# EAGLE design avr (EAGLE 6.5.0)
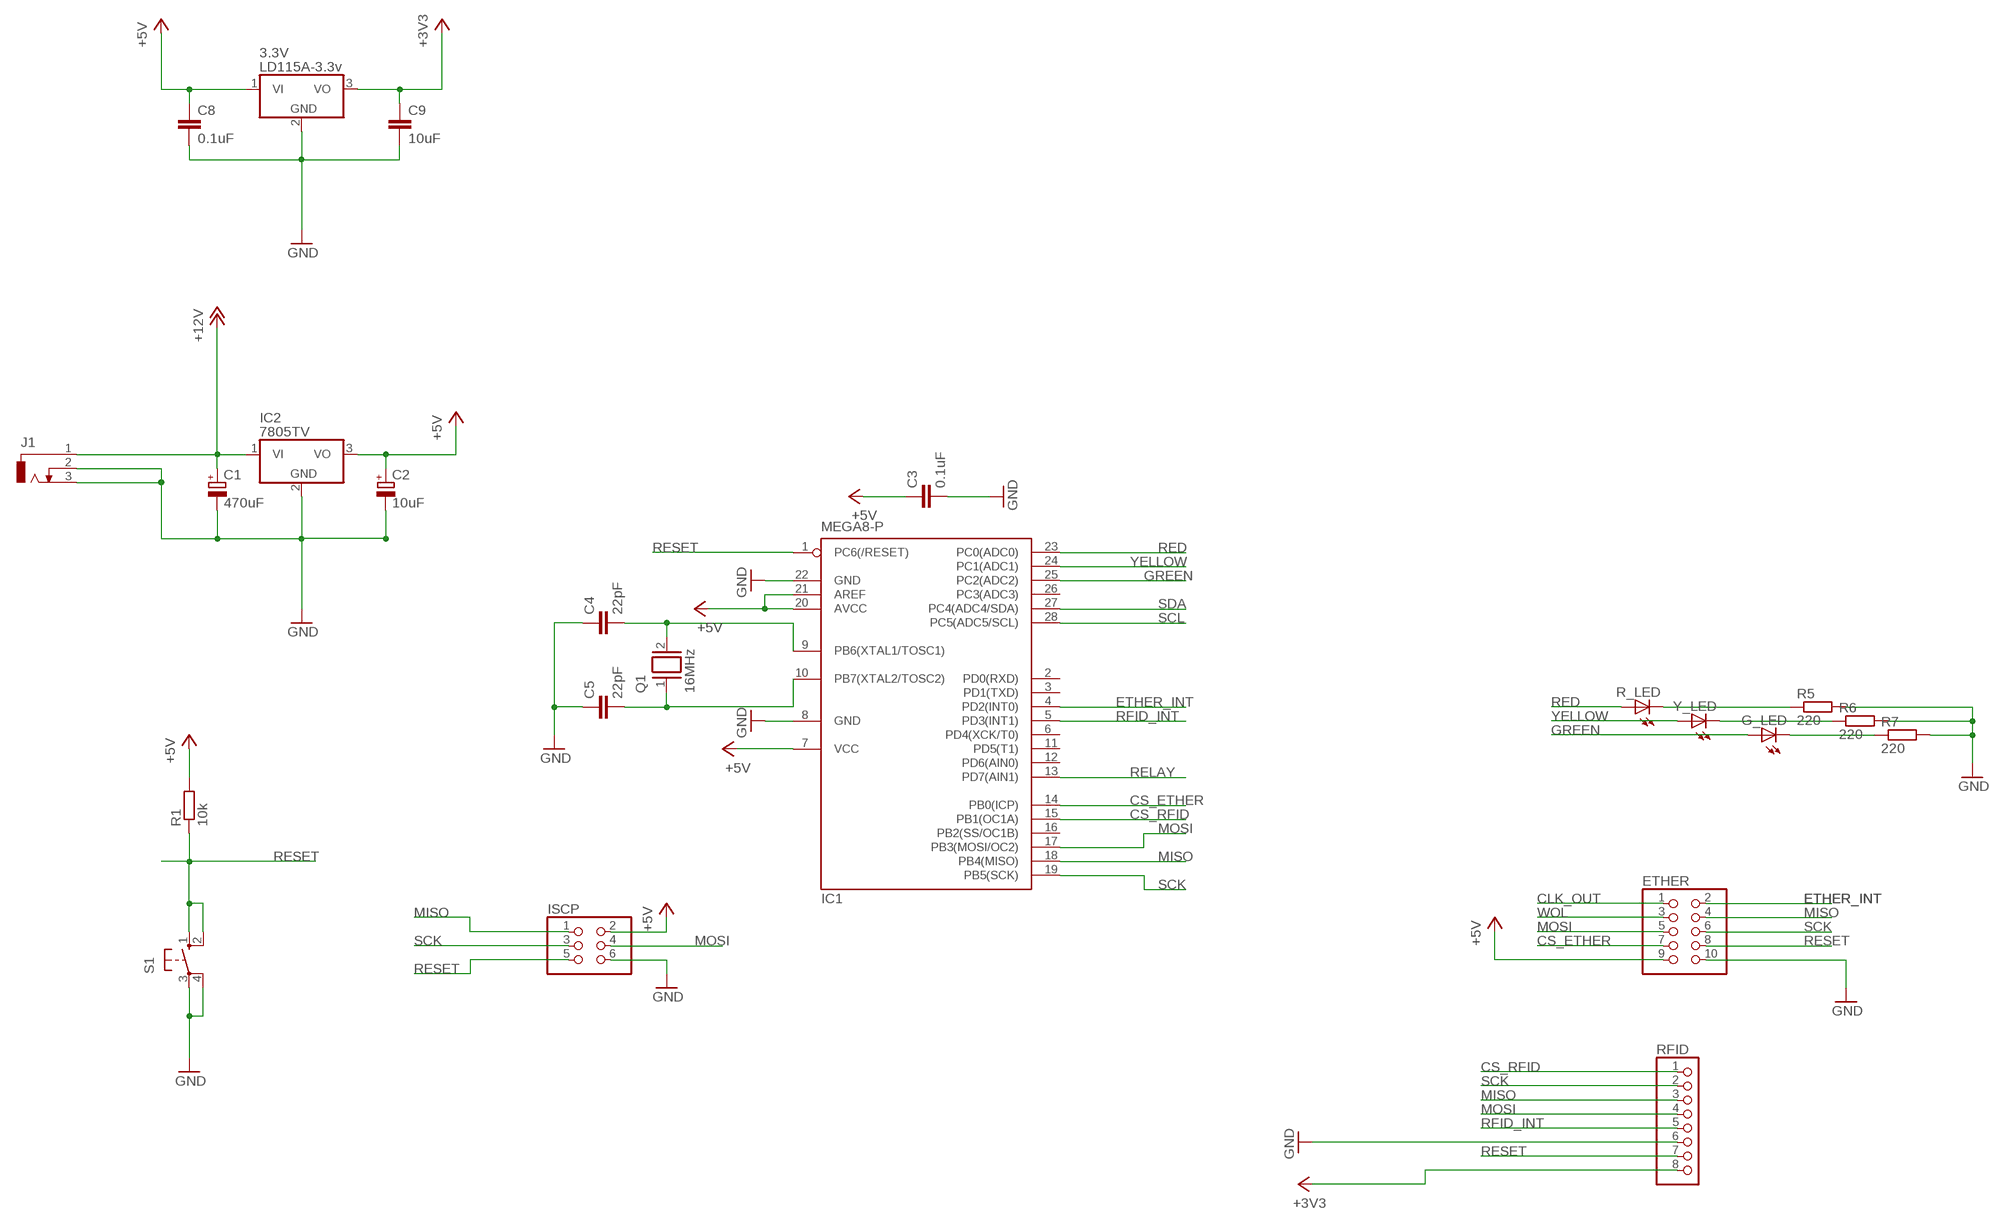
[diagram p0: schematic, sheet 1]

## Parts
3.3V  LD115A-3.3v  7805TV  [TO220V]
C1  470uF  CPOL-EUE3.5-10  [E3,5-10]
C2  10uF  CPOL-EUE3.5-10  [E3,5-10]
C3  0.1uF  C-EU050-025X075  [C050-025X075]
C4  22pF  C-EU050-025X075  [C050-025X075]
C5  22pF  C-EU050-025X075  [C050-025X075]
C8  0.1uF  C-EU050-025X075  [C050-025X075]
C9  10uF  C-EU050-025X075  [C050-025X075]
ETHER  PINHD-2X5  [2X05]
G_LED  LED5MM  [LED5MM]
IC1  MEGA8-P  [DIL28-3]
IC2  7805TV  [TO220V]
ISCP  PINHD-2X3  [2X03]
J1  DCJ0303  [DCJ0303]
Q1  16MHz  XTAL/S  [QS]
R1  10k  R-EU_0207/10  [0207/10]
R5  220  R-EU_0207/10  [0207/10]
R6  220  R-EU_0207/10  [0207/10]
R7  220  R-EU_0207/10  [0207/10]
R_LED  LED5MM  [LED5MM]
RFID  PINHD-1X8  [1X08]
S1  10-XX  [B3F-10XX]
Y_LED  LED5MM  [LED5MM]

## Nets
+3V3: 3.3V.3(VO) C9.1 RFID.8
+5V: 3.3V.1(VI) C2.+ C3.1 C8.1 ETHER.9 IC1.7(VCC) IC1.20(AVCC) IC1.21(AREF) IC2.3(VO) ISCP.2 R1.2
+12V: C1.+ IC2.1(VI) J1.1
CLK_OUT: ETHER.1
CS_ETHER: ETHER.7 IC1.14(PB0(ICP))
CS_RFID: IC1.15(PB1(OC1A)) RFID.1
ETHER_INT: ETHER.2 IC1.4(PD2(INT0))
GND: 3.3V.2(GND) C1.- C2.- C3.2 C4.1 C5.1 C8.2 C9.2 ETHER.10 IC1.8(GND) IC1.22(GND) IC2.2(GND) ISCP.6 J1.2 J1.3 R5.2 R6.2 R7.2 RFID.6 S1.3(P) S1.4(P1)
GREEN: G_LED.A IC1.25(PC2(ADC2))
MISO: ETHER.4 IC1.18(PB4(MISO)) ISCP.1 RFID.3
MOSI: ETHER.5 IC1.17(PB3(MOSI/OC2)) ISCP.4 RFID.4
N$2: R5.1 R_LED.K(C)
N$3: C4.2 IC1.9(PB6(XTAL1/TOSC1)) Q1.2
N$4: R6.1 Y_LED.K(C)
N$5: C5.2 IC1.10(PB7(XTAL2/TOSC2)) Q1.1
N$6: G_LED.K(C) R7.1
RED: IC1.23(PC0(ADC0)) R_LED.A
RELAY: IC1.13(PD7(AIN1))
RESET: ETHER.8 IC1.1(PC6(/RESET)) ISCP.5 R1.1 RFID.7 S1.1(S) S1.2(S1)
RFID_INT: IC1.5(PD3(INT1)) RFID.5
SCK: ETHER.6 IC1.19(PB5(SCK)) ISCP.3 RFID.2
SCL: IC1.28(PC5(ADC5/SCL))
SDA: IC1.27(PC4(ADC4/SDA))
WOL: ETHER.3
YELLOW: IC1.24(PC1(ADC1)) Y_LED.A
Unconnected: IC1.2(PD0(RXD)) IC1.3(PD1(TXD)) IC1.6(PD4(XCK/T0)) IC1.11(PD5(T1)) IC1.12(PD6(AIN0)) IC1.16(PB2(SS/OC1B)) IC1.26(PC3(ADC3))

## Library data of the parts
3.3V IC2 = linear:78*: Positive VOLTAGE REGULATOR Source: http://cache.national.com/ds/LM/LM78L05.pdf http://www.fairchildsemi.com/ds/LM/LM7805.pdf
C1 C2 = resistor:CPOL-EU: POLARIZED CAPACITOR, European symbol
C3-C5 C8 C9 = resistor:C-EU: CAPACITOR, European symbol
ETHER = pinhead:PINHD-2X5: PIN HEADER
G_LED R_LED Y_LED = led:LED: LED OSRAM: - CHIPLED LG R971, LG N971, LY N971, LG Q971, LY Q971, LO R971, LY R971 LH N974, LH R974 LS Q976, LO Q976, LY Q976 LO Q996 - Hyper CHIPLED LW Q18S LB Q993, LB Q99A, LB R99A - SideLED LS A670, LO A670, LY A670, LG A670, LP A670 LB A673, LV A673, LT A673, LW A673 LH A674 LY A675 LS A676, LA A676, LO A676, LY A676, LW A676 LS A679, LY A679, LG A679 - Hyper Micro SIDELED® LS Y876, LA Y876, LO Y876, LY Y876 LT Y87S - SmartLED LW L88C, LW L88S LB L89C, LB L89S, LG L890 LS L89K, LO L89K, LY L89K LS L896, LA L896, LO L896, LY L896 - TOPLED LS T670, LO T670, LY T670, LG T670, LP T670 LSG T670, LSP T670, LSY T670, LOP T670, LYG T670 LG T671, LOG T671, LSG T671 LB T673, LV T673, LT T673, LW T673 LH T674 LS T676, LA T676, LO T676, LY T676, LB T676, LH T676, LSB T676, LW T676 LB T67C, LV T67C, LT T67C, LS T67K, LO T67K, LY T67K, LW E67C LS E67B, LA E67B, LO E67B, LY E67B, LB E67C, LV E67C, LT E67C LW T67C LS T679, LY T679, LG T679 LS T770, LO T770, LY T770, LG T770, LP T770 LB T773, LV T773, LT T773, LW T773 LH T774 LS E675, LA E675, LY E675, LS T675 LS T776, LA T776, LO T776, LY T776, LB T776 LHGB T686 LT T68C, LB T68C - Hyper Mini TOPLED® LB M676 - Mini TOPLED Santana® LG M470 LS M47K, LO M47K, LY M47K Source: http://www.osram.convergy.de LUXEON: - LUMILED® LXK2-PW12-R00, LXK2-PW12-S00, LXK2-PW14-U00, LXK2-PW14-V00 LXK2-PM12-R00, LXK2-PM12-S00, LXK2-PM14-U00 LXK2-PE12-Q00, LXK2-PE12-R00, LXK2-PE12-S00, LXK2-PE14-T00, LXK2-PE14-U00 LXK2-PB12-K00, LXK2-PB12-L00, LXK2-PB12-M00, LXK2-PB14-N00, LXK2-PB14-P00, LXK2-PB14-Q00 LXK2-PR12-L00, LXK2-PR12-M00, LXK2-PR14-Q00, LXK2-PR14-R00 LXK2-PD12-Q00, LXK2-PD12-R00, LXK2-PD12-S00 LXK2-PH12-R00, LXK2-PH12-S00 LXK2-PL12-P00, LXK2-PL12-Q00, LXK2-PL12-R00 Source: www.luxeon.com KINGBRIGHT: KA-3528ASYC Source: www.kingbright.com
IC1 = atmel:MEGA8-P: MICROCONTROLLER 8 Kbytes FLASH, 1 kbytes SRAM, 512 bytes EEPROM, USART, 4-channel 10 bit ADC, 2-channel 8 bit ADC Pin compatible with Atmega48, ATMega88, ATMega168 Source: avr.lbr; OC_FARNELL: unknown; OC_NEWARK: unknown
ISCP = pinhead:PINHD-2X3: PIN HEADER
J1 = con-jack:DCJ0303: DC POWER JACK Source: DCJ0303.pdf; OC_FARNELL: unknown; OC_NEWARK: unknown
Q1 = special:XTAL/S: CRYSTAL
R1 R5-R7 = resistor:R-EU_: RESISTOR, European symbol
RFID = pinhead:PINHD-1X8: PIN HEADER
S1 = switch-omron:10-XX: OMRON SWITCH; MPN: B3F-1000; OC_FARNELL: 176432; OC_NEWARK: 36M3542

## Board
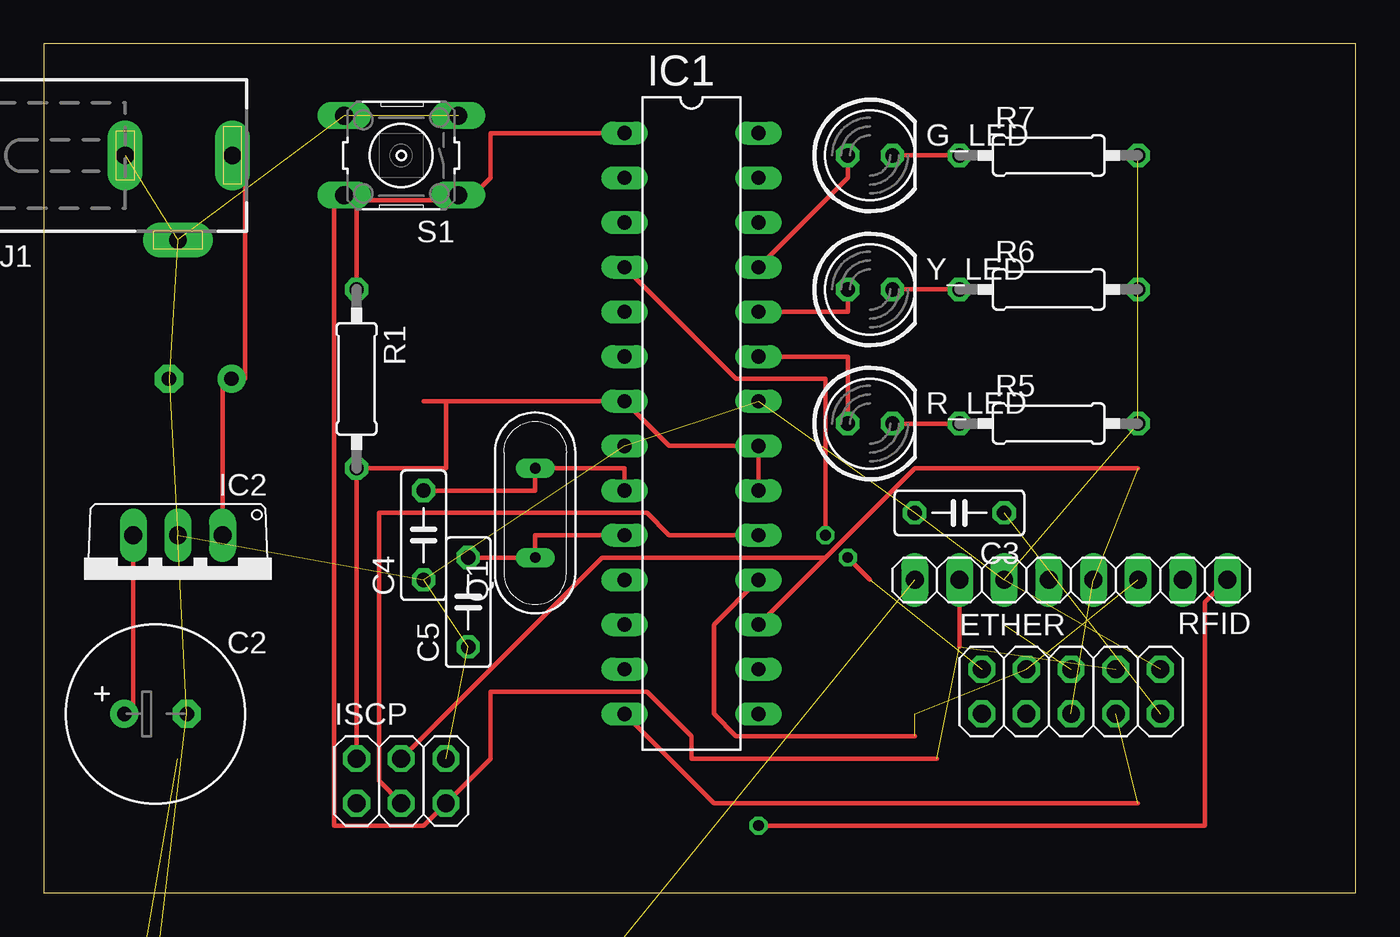
[diagram p1: board, top side]
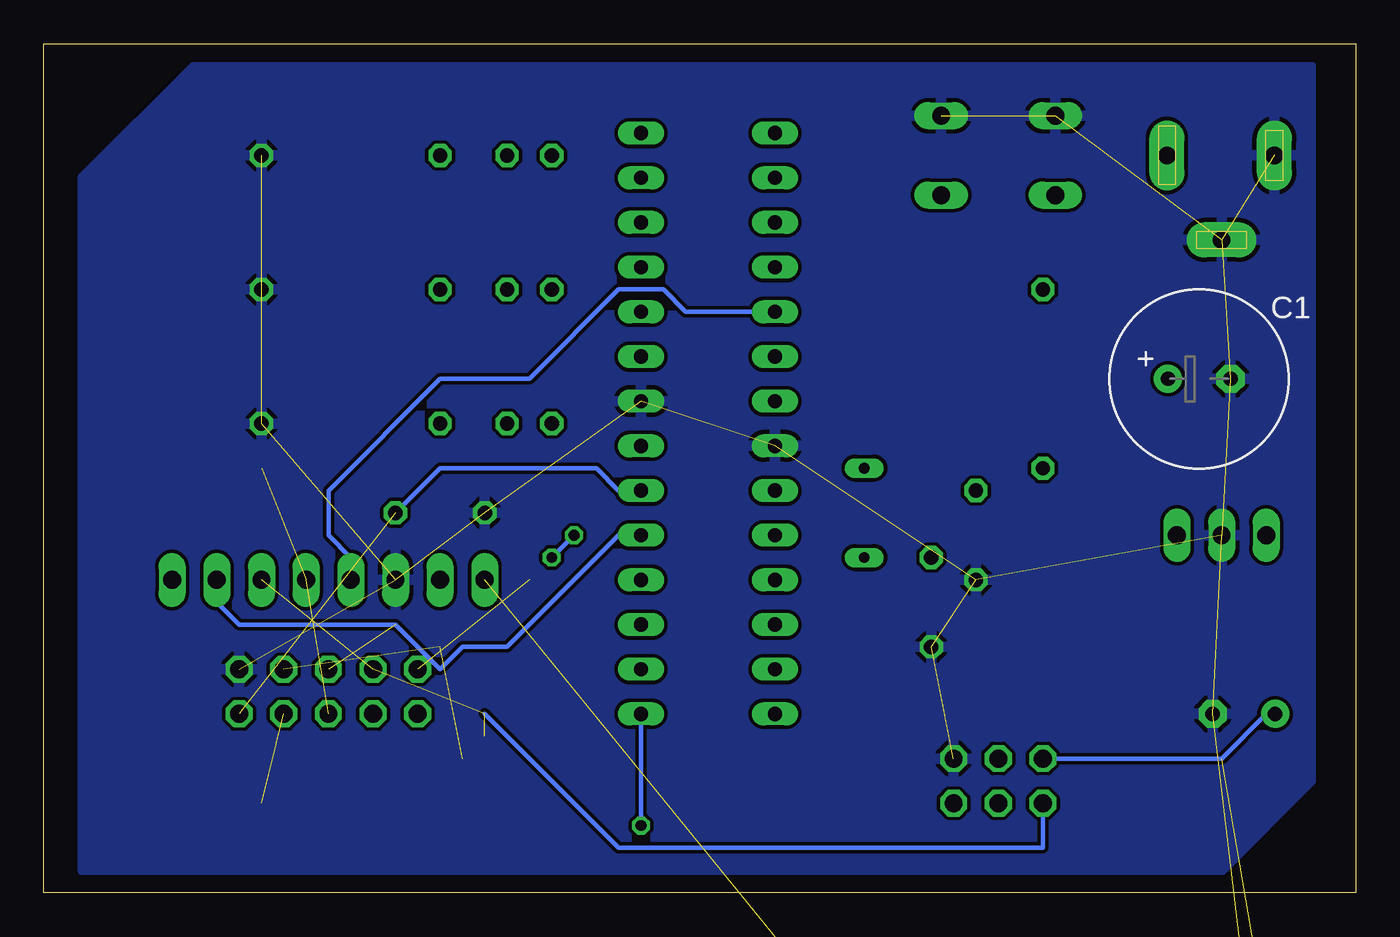
[diagram p2: board, bottom side, seen from below]

Size 74.6 x 48.25 mm. Coordinates in mm from the lower left corner, seen from the top.
Outline: 0,0 74.6,0 74.6,48.25 0,48.25 0,0
Copper layers (1*16): Top 0.035mm / dielectric 1.5mm / Bottom 0.035mm
Design rules "default": minimum track width 10mil, minimum drill 24mil, track to track 8mil, track to pad 8mil, pad to pad 8mil, via to via 8mil, smd to smd 8mil, copper to edge 40mil, drill to drill 8mil, minimum pad ring 10mil, minimum via ring 8mil, stop-mask expansion 4mil, vias tented up to drill 0mil, thermal gap 10mil

### Footprints (pad centres in the part's own frame; a part is rotated, then mirrored left to right if it is on the bottom)
TO220V = drill 1.016 long: 1 -2.54,-2.54; 2 0,-2.54; 3 2.54,-2.54
E3,5-10 = drill 0.813 pad 1.6: + -1.778,0 | drill 0.813 pad 1.6 octagon: - 1.778,0
C050-025X075 = drill 0.813 octagon: 1 -2.54,0; 2 2.54,0
2X05 = drill 1.016 octagon: 1 -5.08,-1.27; 2 -5.08,1.27; 3 -2.54,-1.27; 4 -2.54,1.27; 5 0,-1.27; 6 0,1.27; 7 2.54,-1.27; 8 2.54,1.27; 9 5.08,-1.27; 10 5.08,1.27
LED5MM = drill 0.813 octagon: A -1.27,0; K 1.27,0
DIL28-3 = drill 0.813 long: 1 -16.51,-3.81; 2 -13.97,-3.81; 3 -11.43,-3.81; 4 -8.89,-3.81; 5 -6.35,-3.81; 6 -3.81,-3.81; 7 -1.27,-3.81; 8 1.27,-3.81; 9 3.81,-3.81; 10 6.35,-3.81; 11 8.89,-3.81; 12 11.43,-3.81; 13 13.97,-3.81; 14 16.51,-3.81; 15 16.51,3.81; 16 13.97,3.81; 17 11.43,3.81; 18 8.89,3.81; 19 6.35,3.81; 20 3.81,3.81; 21 1.27,3.81; 22 -1.27,3.81; 23 -3.81,3.81; 24 -6.35,3.81; 25 -8.89,3.81; 26 -11.43,3.81; 27 -13.97,3.81; 28 -16.51,3.81
2X03 = drill 1.016 octagon: 1 -2.54,-1.27; 2 -2.54,1.27; 3 0,-1.27; 4 0,1.27; 5 2.54,-1.27; 6 2.54,1.27
DCJ0303 = drill 1 pad 2 long: 1 0,3.1; 2 4.8,0; 3 0,-3
QS = drill 0.61 long: 1 -2.54,0; 2 2.54,0
0207/10 = drill 0.813 octagon: 1 -5.08,0; 2 5.08,0
1X08 = drill 1.016 long: 1 -8.89,0; 2 -6.35,0; 3 -3.81,0; 4 -1.27,0; 5 1.27,0; 6 3.81,0; 7 6.35,0; 8 8.89,0
B3F-10XX = drill 1.016 long: 1 -3.251,2.261; 2 3.251,2.261; 3 -3.251,-2.261; 4 3.251,-2.261

### Placement (x,y rotation side)
3.3V  2.54,-34.29 0 top  (outside the outline)
C1  8.89,29.21 0 bottom
C2  6.35,10.16 0 top
C3  52.07,21.59 180 top
C4  21.59,20.32 90 top
C5  24.13,16.51 90 top
C8  1.27,-46.99 0 top  (outside the outline)
C9  1.27,-52.07 0 top  (outside the outline)
ETHER  58.42,11.43 0 top
G_LED  46.99,41.91 0 top
IC1  36.83,26.67 270 top
IC2  7.62,17.78 180 top
ISCP  20.32,6.35 0 top
J1  7.62,41.91 270 top
Q1  27.94,21.59 90 top
R1  17.78,29.21 270 top
R5  57.15,26.67 0 top
R6  57.15,34.29 0 top
R7  57.15,41.91 0 top
R_LED  46.99,26.67 0 top
RFID  58.42,17.78 180 top
S1  20.32,41.91 180 top
Y_LED  46.99,34.29 0 top

### Tracks (layer width: path | path; a pad name or v marks a point on that pad's centre or on a via)
+3V3  (2 unrouted)
+5V  (3 unrouted)
  Top 0.254: IC2.3 5.08,10.16 C2.+ | ISCP.2 R1.2 22.86,24.13 22.86,27.94 | IC1.20 IC1.21 35.56,25.4 IC1.7 22.86,27.94 | 21.59,27.94 22.86,27.94
  Bottom 0.254: ISCP.2 7.62,7.62 5.08,10.16 C2.+ | C3.1 52.07,24.13 43.18,24.13 41.91,22.86 IC1.20
+12V
  Top 0.254: IC2.1 10.16,29.21 C1.+ 11.43,29.21 11.43,41.91 J1.1
CS_ETHER  (1 unrouted)
  Top 0.254: IC1.14 38.1,5.08 62.23,5.08
CS_RFID  (via drill 0.61)
  Top 0.254: v40.64,3.81 66.04,3.81 66.04,16.51 RFID.1
  Bottom 0.254: v40.64,3.81 IC1.15
ETHER_INT  (via drill 0.61)  (1 unrouted)
  Top 0.254: IC1.4 39.37,29.21 44.45,29.21 v44.45,20.32 | 46.99,17.78 v45.72,19.05
  Bottom 0.254: v45.72,19.05 v44.45,20.32
GND  (20 unrouted)
  pour Bottom: 2.54,46.99 66.04,46.99 72.39,40.64 72.39,1.27 7.62,1.27 2.54,6.35
GREEN
  Top 0.254: IC1.25 45.72,40.64 G_LED.A
MISO  (3 unrouted)
  Top 0.254: IC1.18 38.1,15.24 38.1,10.16 39.37,8.89 49.53,8.89
  Bottom 0.254: ISCP.1 17.78,2.54 41.91,2.54 49.53,10.16
MOSI  (2 unrouted)
  Top 0.254: 44.45,19.05 49.53,24.13 62.23,24.13 | 44.45,19.05 IC1.17 | ISCP.4 31.75,19.05 44.45,19.05
N$2
  Top 0.254: R5.1 R_LED.K
N$3
  Top 0.254: IC1.9 33.02,24.13 Q1.2 27.94,22.86 C4.2
N$4
  Top 0.254: R6.1 Y_LED.K
N$5
  Top 0.254: C5.2 Q1.1 27.94,20.32 IC1.10
N$6
  Top 0.254: R7.1 G_LED.K
RED
  Top 0.254: IC1.23 45.72,30.48 R_LED.A
RESET  (2 unrouted)
  Top 0.254: IC1.1 25.4,43.18 25.4,40.64 24.13,39.37 S1.1 22.86,39.37 17.78,39.37 | RFID.7 52.07,13.97 | 17.78,39.37 R1.1 | 50.8,7.62 36.83,7.62 36.83,8.89 34.29,11.43 25.4,11.43 25.4,7.62 ISCP.5 21.59,3.81 16.51,3.81 16.51,39.37 S1.2 17.78,39.37
RFID_INT
  Bottom 0.254: IC1.5 38.1,33.02 39.37,34.29 41.91,34.29 46.99,29.21 52.07,29.21 58.42,22.86 58.42,20.32 57.15,19.05 RFID.5
SCK  (1 unrouted)
  Top 0.254: IC1.19 35.56,20.32 34.29,21.59 19.05,21.59 19.05,6.35 ISCP.3
  Bottom 0.254: IC1.19 41.91,20.32 48.26,13.97 50.8,13.97 52.07,12.7 54.61,15.24 63.5,15.24 64.77,16.51 RFID.2
YELLOW
  Top 0.254: IC1.24 45.72,33.02 Y_LED.A